# EAGLE design srf08 (EAGLE 5.04)
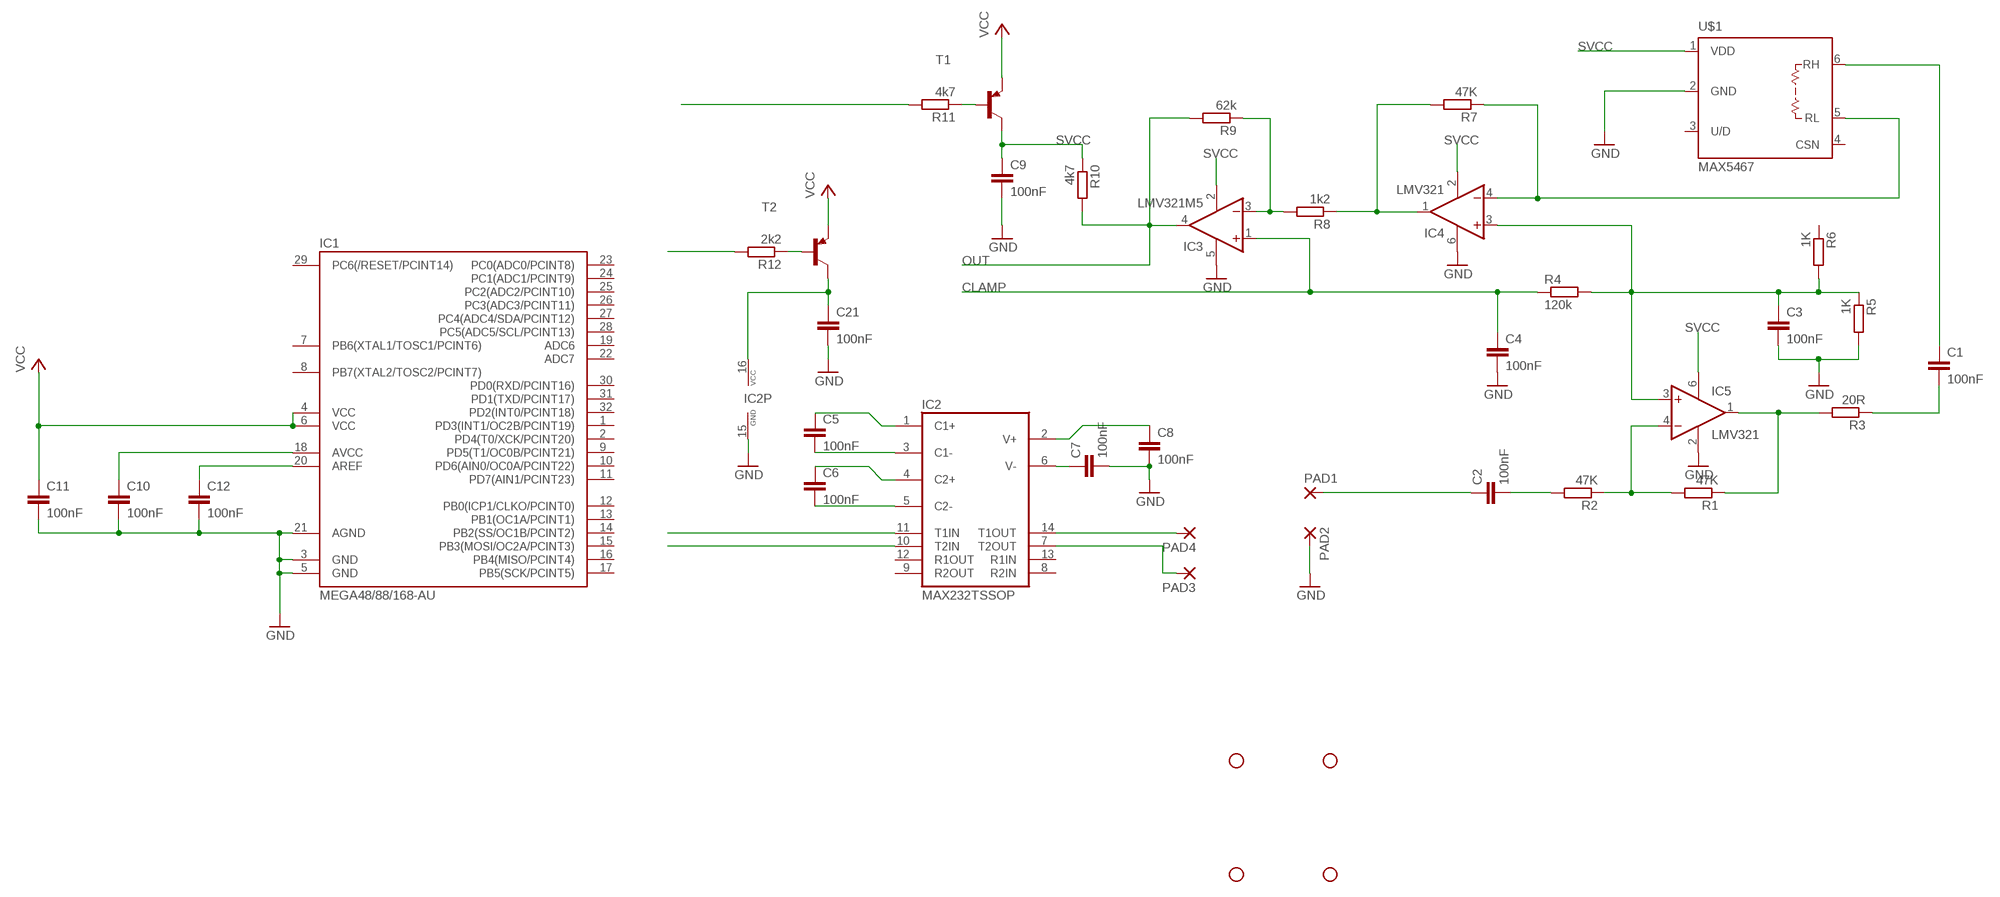
[diagram p0: schematic, sheet 1]

## Parts
C1  100nF  C-EUC1206K  [C1206K]
C2  100nF  C-EUC1206K  [C1206K]
C3  100nF  C-EUC1206K  [C1206K]
C4  100nF  C-EUC1206K  [C1206K]
C5  100nF  C-EUC1206K  [C1206K]
C6  100nF  C-EUC1206K  [C1206K]
C7  100nF  C-EUC1206K  [C1206K]
C8  100nF  C-EUC1206K  [C1206K]
C9  100nF  C-EUC1206K  [C1206K]
C10  100nF  C-EUC1206K  [C1206K]
C11  100nF  C-EUC1206K  [C1206K]
C12  100nF  C-EUC1206K  [C1206K]
C21  100nF  C-EUC1206K  [C1206K]
IC1  MEGA48/88/168-AU  [TQFP32-08]
IC2  MAX232TSSOP  [TSSOP16SH]
IC3  LMV321M5  [SOT23-5]
IC4  LMV321  [SOT23-6]
IC5  LMV321  [SOT23-6]
PAD1  2,54/0,8  [2,54/0,8]
PAD2  2,54/0,8  [2,54/0,8]
PAD3  2,54/0,8  [2,54/0,8]
PAD4  2,54/0,8  [2,54/0,8]
R1  47K  R-EU_R0805  [R0805]
R2  47K  R-EU_R0805  [R0805]
R3  20R  R-EU_R0805  [R0805]
R4  120k  R-EU_R0805  [R0805]
R5  1K  R-EU_R0805  [R0805]
R6  1K  R-EU_R0805  [R0805]
R7  47K  R-EU_R0805  [R0805]
R8  1k2  R-EU_R0805  [R0805]
R9  62k  R-EU_R0805  [R0805]
R10  4k7  R-EU_R0805  [R0805]
R11  4k7  R-EU_R0805  [R0805]
R12  2k2  R-EU_R0805  [R0805]
T1  BC807-25-PNP-SOT23-BEC  [SOT23-BEC]
T2  BC807-25-PNP-SOT23-BEC  [SOT23-BEC]
U$1  MAX5467  [SOT23-6L]
U$4  STAND-OFF  [STAND-OFF]
U$5  STAND-OFF  [STAND-OFF]
U$6  STAND-OFF  [STAND-OFF]
U$7  STAND-OFF  [STAND-OFF]

## Nets
CLAMP: C4.1 IC3.1(+IN) R4.1
GND: C3.2 C4.2 C7.2 C8.2 C9.2 C10.2 C11.2 C12.2 C21.2 IC1.3(GND) IC1.5(GND) IC1.21(AGND) IC2.15(GND) IC3.5(V+) IC4.6(V+) IC5.2(V-) PAD2.1(P) R5.2 U$1.2(GND)
N$1: IC5.1(OUT) R1.1 R3.2
N$2: C1.2 R3.1
N$3: C1.1 U$1.6(RH)
N$4: IC5.4(-IN) R1.2 R2.1
N$5: C2.2 R2.2
N$6: C2.1 PAD1.1(P)
N$7: IC4.4(-IN) R7.1 U$1.5(RL)
N$8: C3.1 IC4.3(+IN) IC5.3(+IN) R4.2 R5.1 R6.2
N$9: IC3.3(-IN) R8.2 R9.1
N$11: IC4.1(OUT) R7.2 R8.1
N$13: IC2.7(T2OUT) PAD3.1(P)
N$14: IC2.14(T1OUT) PAD4.1(P)
N$15: C5.2 IC2.3(C1-)
N$16: C5.1 IC2.1(C1+)
N$17: C6.2 IC2.5(C2-)
N$18: C6.1 IC2.4(C2+)
N$19: IC2.11(T1IN)
N$20: IC2.10(T2IN)
N$21: C7.1 IC2.6(V-)
N$22: C8.1 IC2.2(V+)
N$23: R12.1 T2.B
N$24: R11.1 T1.B
N$25: C21.1 IC2.16(VCC) T2.C
N$26: R12.2
N$28: R11.2
N$29: C12.1 IC1.20(AREF)
N$30: C10.1 IC1.18(AVCC)
OUT: IC3.4(OUT) R9.2 R10.2
SVCC: C9.1 IC3.2(V-) IC4.2(V-) IC5.6(V+) R10.1 T1.C U$1.1(VDD)
VCC: C11.1 IC1.4(VCC) IC1.6(VCC) T1.E T2.E
Unconnected: IC1.1(PD3(INT1/OC2B/PCINT19)) IC1.2(PD4(T0/XCK/PCINT20)) IC1.7(PB6(XTAL1/TOSC1/PCINT6)) IC1.8(PB7(XTAL2/TOSC2/PCINT7)) IC1.9(PD5(T1/OC0B/PCINT21)) IC1.10(PD6(AIN0/OC0A/PCINT22)) IC1.11(PD7(AIN1/PCINT23)) IC1.12(PB0(ICP1/CLKO/PCINT0)) IC1.13(PB1(OC1A/PCINT1)) IC1.14(PB2(SS/OC1B/PCINT2)) IC1.15(PB3(MOSI/OC2A/PCINT3)) IC1.16(PB4(MISO/PCINT4)) IC1.17(PB5(SCK/PCINT5)) IC1.19(ADC6) IC1.22(ADC7) IC1.23(PC0(ADC0/PCINT8)) IC1.24(PC1(ADC1/PCINT9)) IC1.25(PC2(ADC2/PCINT10)) IC1.26(PC3(ADC3/PCINT11)) IC1.27(PC4(ADC4/SDA/PCINT12)) IC1.28(PC5(ADC5/SCL/PCINT13)) IC1.29(PC6(/RESET/PCINT14)) IC1.30(PD0(RXD/PCINT16)) IC1.31(PD1(TXD/PCINT17)) IC1.32(PD2(INT0/PCINT18)) IC2.8(R2IN) IC2.9(R2OUT) IC2.12(R1OUT) IC2.13(R1IN) R6.1 U$1.3(U/D) U$1.4(CSN)

## Library data of the parts
C1-C12 C21 = rcl:C-EU: CAPACITOR, European symbol
IC1 = avr-5:MEGA48/88/168
IC2 = maxim:MAX232: RS232 TRANSEIVER
IC3-IC5 = linear:LMV321?*: General Purpose, Low Voltage, Rail-to-Rail Output Operational Amplifiers Source: http://www.national.com/mpf/LM/LMV321.html http://www.national.com/dt/lmv_qual.pdf
PAD1-PAD4 = wirepad:2,54/0,8: THROUGH-HOLE PAD
R1-R12 = rcl:R-EU_: RESISTOR, European symbol
T1 T2 = transistor:*-PNP-: PNP Transistror
U$1 = maxim:MAX5467
U$4-U$7 = SparkFun:STAND-OFF: Stand Off This is the mechanical footprint for a #4 phillips button head screw. Use the keepout ring to avoid running the screw head into surrounding components. SKU : PRT-00447

## Board
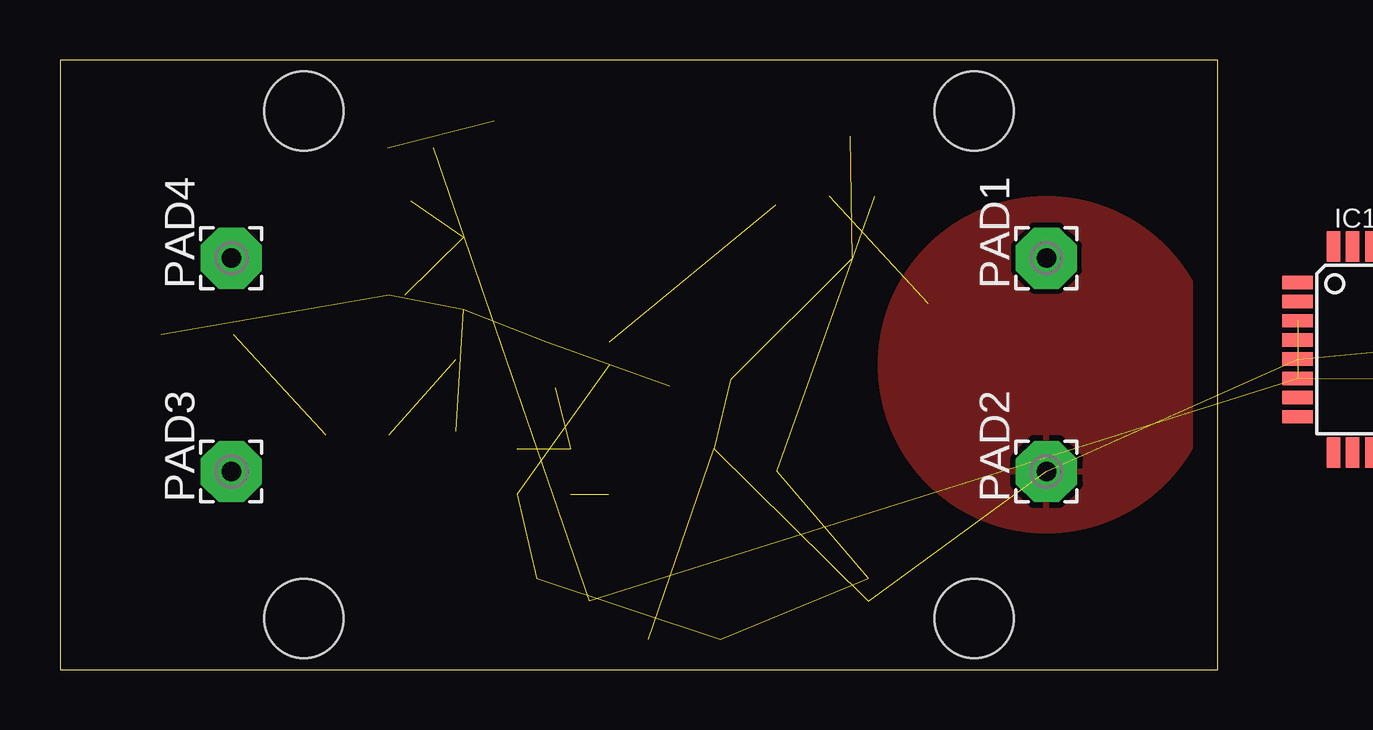
[diagram p1: board, top side]
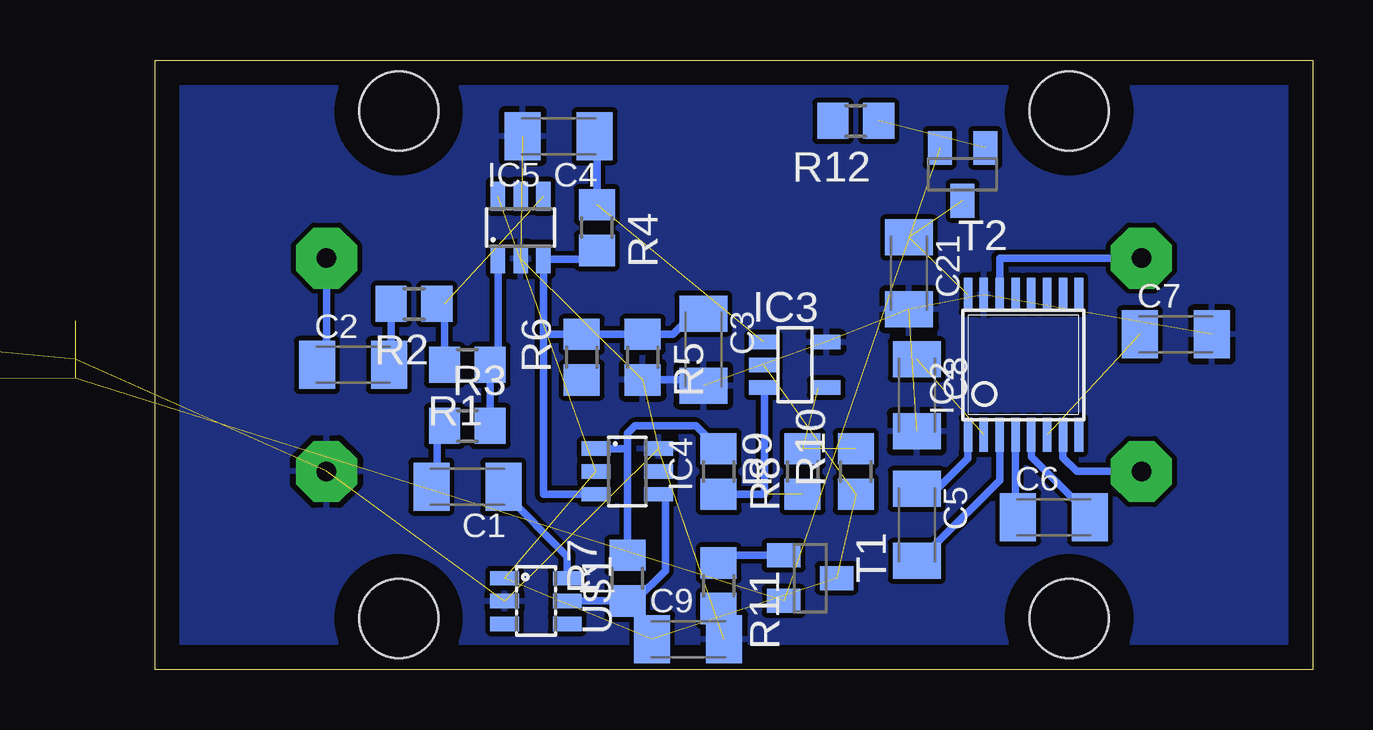
[diagram p2: board, bottom side, seen from below]

Size 48.26 x 25.4 mm. Coordinates in mm from the lower left corner, seen from the top.
Outline: 0,0 48.26,0 48.26,25.4 0,25.4 0,0
Copper layers (1*16): Top 0.035mm / dielectric 1.5mm / Bottom 0.035mm
Design rules "default": minimum track width 10mil, minimum drill 24mil, track to track 8mil, track to pad 8mil, pad to pad 8mil, via to via 8mil, smd to smd 8mil, copper to edge 40mil, drill to drill 8mil, minimum pad ring 10mil, minimum via ring 8mil, stop-mask expansion 4mil, vias tented up to drill 0mil, thermal gap 10mil
tRestrict: area 0,5.6 to 14.3,19.8; area 34,5.6 to 48.3,19.8

### Footprints (pad centres in the part's own frame; a part is rotated, then mirrored left to right if it is on the bottom)
C1206K = smd 1.5 x 2: 1 -1.5,0; 2 1.5,0
TQFP32-08 = smd 1.27 x 0.559: 1 -4.293,2.8; 2 -4.293,2; 3 -4.293,1.2; 4 -4.293,0.4; 5 -4.293,-0.4; 6 -4.293,-1.2; 7 -4.293,-2; 8 -4.293,-2.8; 17 4.293,-2.8; 18 4.293,-2; 19 4.293,-1.2; 20 4.293,-0.4; 21 4.293,0.4; 22 4.293,1.2; 23 4.293,2; 24 4.293,2.8 | smd 0.559 x 1.27: 9 -2.8,-4.293; 10 -2,-4.293; 11 -1.2,-4.293; 12 -0.4,-4.293; 13 0.4,-4.293; 14 1.2,-4.293; 15 2,-4.293; 16 2.8,-4.293; 25 2.8,4.293; 26 2,4.293; 27 1.2,4.293; 28 0.4,4.293; 29 -0.4,4.293; 30 -1.2,4.293; 31 -2,4.293; 32 -2.8,4.293
TSSOP16SH = smd 0.356 x 1.422: 1 -2.311,-2.921; 2 -1.651,-2.921; 3 -0.991,-2.921; 4 -0.33,-2.921; 5 0.33,-2.921; 6 0.991,-2.921; 7 1.651,-2.921; 8 2.311,-2.921; 9 2.311,2.921; 10 1.651,2.921; 11 0.991,2.921; 12 0.33,2.921; 13 -0.33,2.921; 14 -0.991,2.921; 15 -1.651,2.921; 16 -2.311,2.921
SOT23-5 = smd 0.6 x 1.2: 1 -0.95,-1.306; 2 0,-1.306; 3 0.95,-1.306; 4 0.95,1.306; 5 -0.95,1.306
SOT23-6 = smd 0.6 x 1.2: 1 -0.95,-1.306; 2 0,-1.306; 3 0.95,-1.306; 4 0.95,1.306; 5 0,1.306; 6 -0.95,1.306
2,54/0,8 = drill 0.813 pad 2.54 octagon: 1 0,0
R0805 = smd 1.3 x 1.5: 1 -0.95,0; 2 0.95,0
SOT23-BEC = smd 1 x 1.4: B -0.95,-1.1; C 0,1.1; E 0.95,-1.1
SOT23-6L = smd 0.6 x 1.2: 1 -0.95,-1.306; 2 0,-1.306; 3 0.95,-1.306; 4 0.95,1.306; 5 0,1.306; 6 -0.95,1.306
STAND-OFF = hole 3.302: 0,0

### Placement (x,y rotation side)
C1  35.24,7.62 180 bottom
C2  40.01,12.7 0 bottom
C3  25.4,13.34 270 bottom
C4  31.43,22.23 180 bottom
C5  16.51,6.03 270 bottom
C6  10.79,6.35 0 bottom
C7  5.71,13.97 0 bottom
C8  16.51,11.43 270 bottom
C9  26.04,1.27 0 bottom
C10  77.47,16.51 0 top  (outside the outline)
C11  69.85,12.06 0 top  (outside the outline)
C12  68.58,19.05 0 top  (outside the outline)
C21  16.83,16.51 270 bottom
IC1  55.88,13.34 0 top  (outside the outline)
IC2  12.06,12.7 0 bottom
IC3  21.59,12.7 270 bottom
IC4  28.57,8.26 270 bottom
IC5  33.02,18.41 0 bottom
PAD1  41.12,17.14 90 top
PAD2  41.12,8.26 90 top
PAD3  7.14,8.26 90 top
PAD4  7.14,17.14 90 top
R1  35.24,12.7 180 bottom
R2  37.47,15.24 180 bottom
R3  35.24,10.16 0 bottom
R4  29.84,18.41 270 bottom
R5  27.94,13.02 270 bottom
R6  30.48,13.02 90 bottom
R7  28.57,3.81 90 bottom
R8  24.77,8.26 270 bottom
R9  21.27,8.26 90 bottom
R10  19.05,8.26 90 bottom
R11  24.77,3.49 270 bottom
R12  19.05,22.86 180 bottom
T1  20.95,3.81 270 bottom
T2  14.61,20.64 180 bottom
U$1  32.38,2.86 270 bottom
U$4  10.16,2.13 0 top
U$5  10.16,23.27 0 top
U$6  38.1,23.27 0 top
U$7  38.1,2.13 0 top

### Tracks (layer width: path | path; a pad name or v marks a point on that pad's centre or on a via)
CLAMP  (1 unrouted)
  Bottom 0.305: R4.1 29.84,22.14 C4.1
GND  (17 unrouted)
  Bottom 0.305: R5.2 25.63,12.07 C3.2
  pour Top: 0,25.4 48.26,25.4 48.26,0 0,0
  pour Bottom: 0,25.4 48.26,25.4 48.26,0 0,0
N$1
  Bottom 0.305: R3.2 R1.1 33.97,13.02 IC5.1
N$2
  Bottom 0.305: R3.1 36.51,10.16 36.51,7.85 C1.2
N$3
  Bottom 0.305: U$1.6 31.08,4.73 33.74,7.39 C1.1
N$4  (1 unrouted)
  Bottom 0.305: 36.2,12.39 R1.2 36.19,15.24 R2.1
N$5
  Bottom 0.305: C2.2 38.41,12.7 R2.2
N$6
  Bottom 0.305: C2.1 41.12,13.09 PAD1.1
N$7
  Bottom 0.305: U$1.5 R7.1 28.25,2.86 26.99,4.13 26.99,7.3 IC4.4
N$8
  Bottom 0.305: IC4.3 32.07,7.3 32.07,13.97 | R6.2 30.8,13.97 | R6.2 R5.1 26.67,13.97 25.8,14.84 C3.1 | 32.07,13.97 IC5.3 | IC5.3 | R6.2 32.06,13.97 32.07,13.97 | IC5.3 30.2,17.11 R4.2
N$9  (1 unrouted)
  Bottom 0.305: R8.2 22.86,7.3 22.86,11.71 IC3.3
N$11
  Bottom 0.305: 28.57,9.21 IC4.1 | 28.57,9.21 R7.2 | R8.1 25.72,10.16 28.26,10.16 28.57,9.84 28.57,9.21
N$13
  Bottom 0.305: IC2.7 10.41,8.83 9.84,8.26 PAD3.1
N$14
  Bottom 0.305: IC2.14 13.06,17.14 PAD4.1
N$15
  Bottom 0.305: C5.2 15.96,5.08 15.88,5.08 13.06,7.9 IC2.3
N$16
  Bottom 0.305: IC2.1 14.38,8.8 15.88,7.3 16.28,7.3 C5.1
N$17
  Bottom 0.305: IC2.5 11.73,8.88 9.29,6.44 C6.2
N$18
  Bottom 0.305: IC2.4 12.39,6.35 C6.1
N$21  (1 unrouted)
N$22  (1 unrouted)
N$23  (1 unrouted)
N$24
  Bottom 0.305: R11.1 24.77,4.76 T1.B
N$25  (2 unrouted)
N$29  (1 unrouted)
N$30  (1 unrouted)
OUT  (2 unrouted)
  Bottom 0.305: IC3.4 20.32,11.75 20.64,11.75
SVCC  (6 unrouted)
VCC  (4 unrouted)